# EAGLE design base-6u-db-opto-input (EAGLE 5.06)
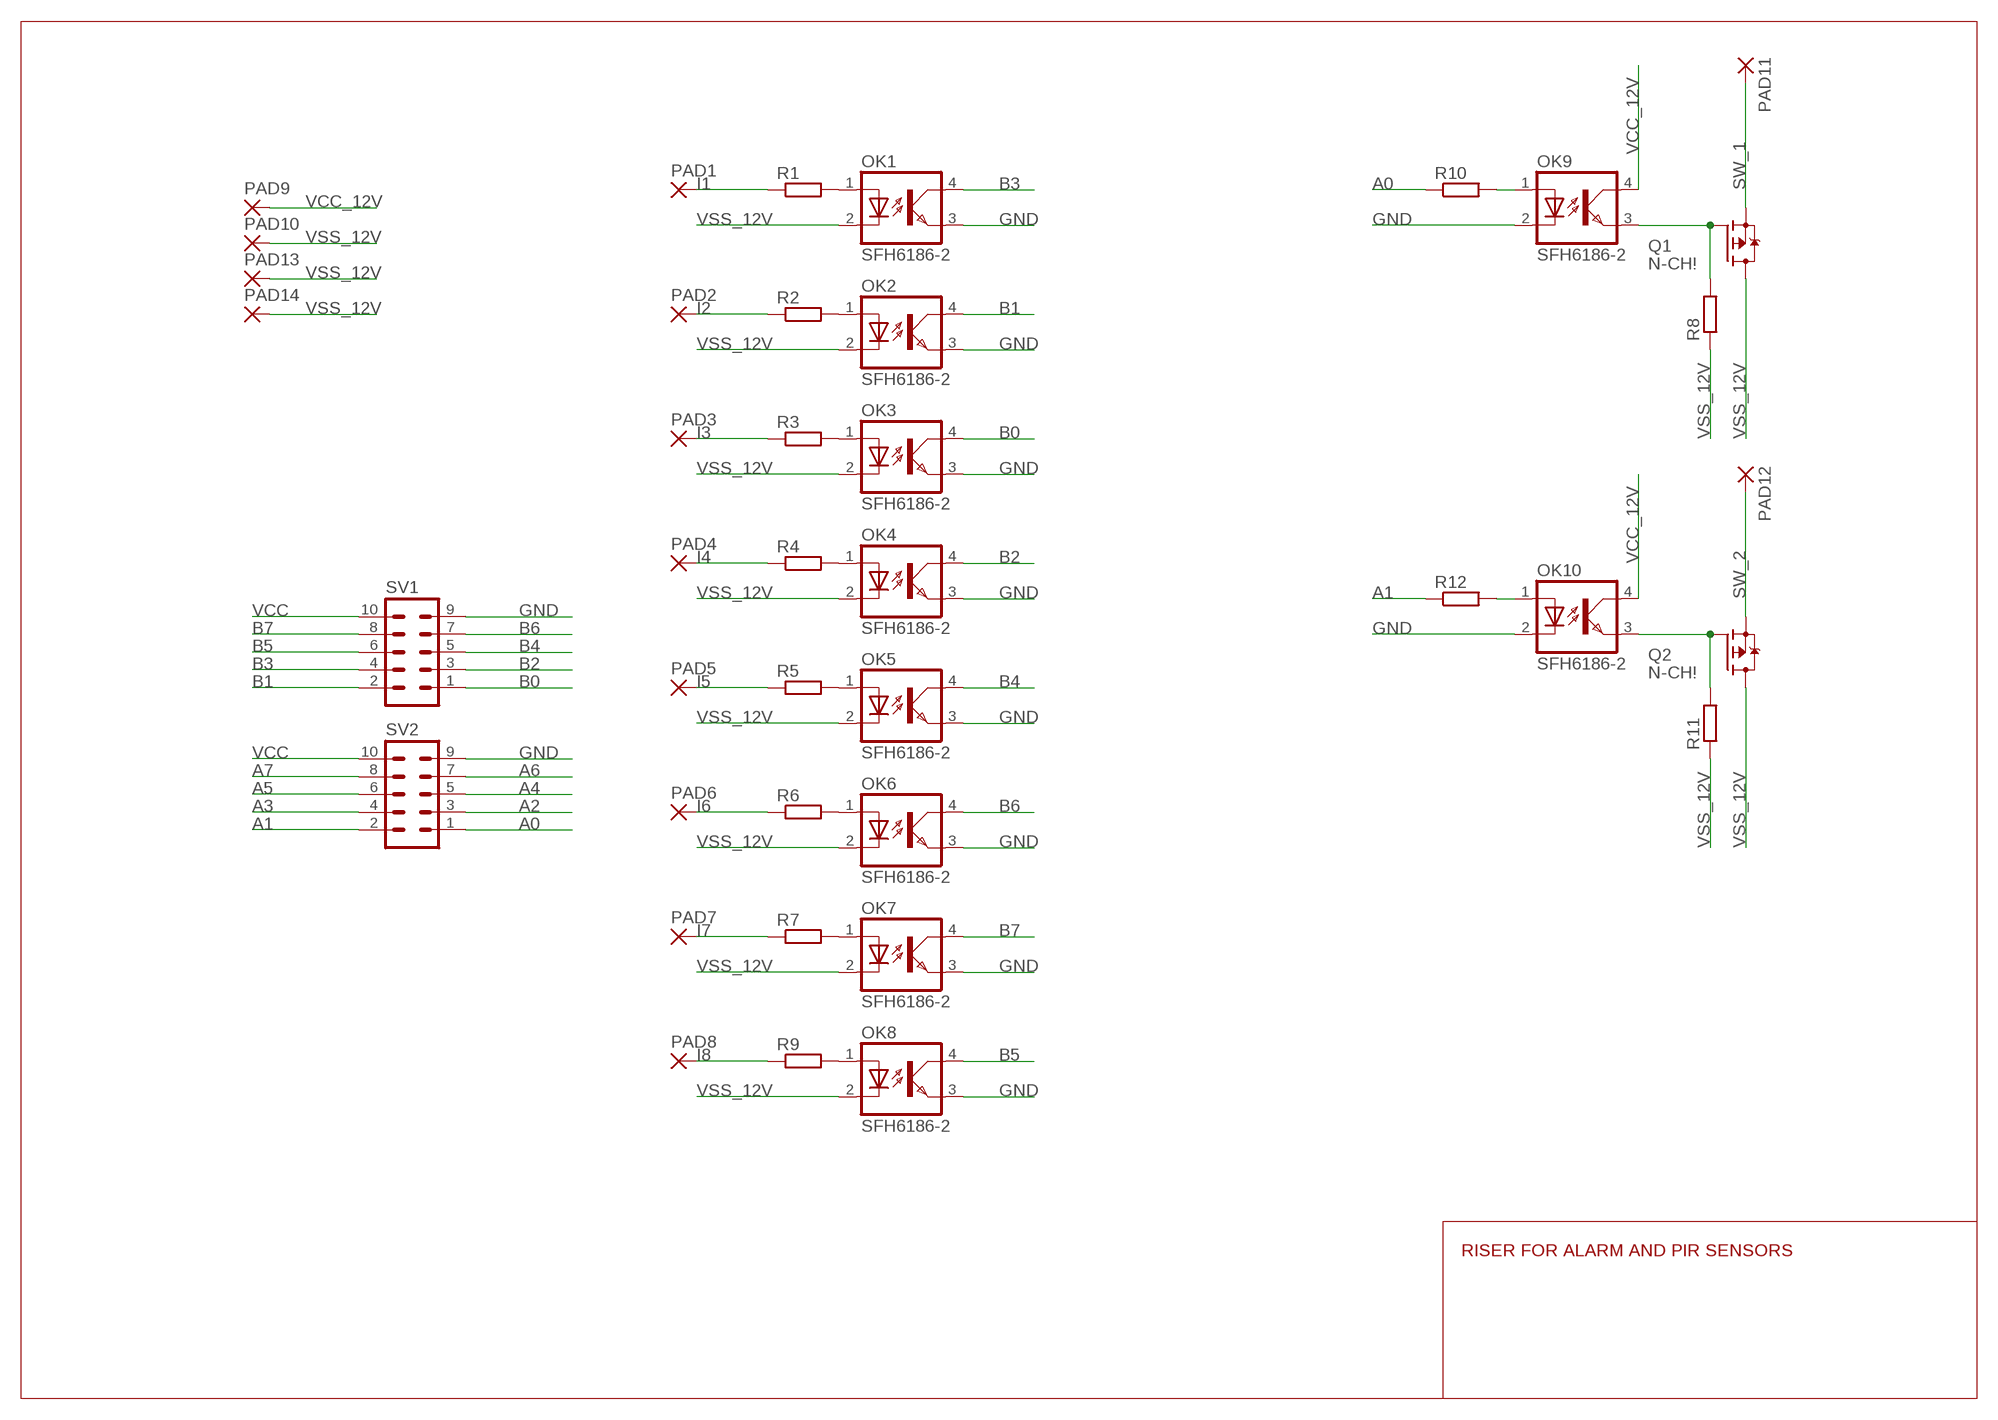
[diagram p0: schematic, sheet 1]

## Parts
OK1  SFH6186-2  [SMD4]
OK2  SFH6186-2  [SMD4]
OK3  SFH6186-2  [SMD4]
OK4  SFH6186-2  [SMD4]
OK5  SFH6186-2  [SMD4]
OK6  SFH6186-2  [SMD4]
OK7  SFH6186-2  [SMD4]
OK8  SFH6186-2  [SMD4]
OK9  SFH6186-2  [SMD4]
OK10  SFH6186-2  [SMD4]
PAD1  2,15/1,0  [2,15/1,0]
PAD2  2,15/1,0  [2,15/1,0]
PAD3  2,15/1,0  [2,15/1,0]
PAD4  2,15/1,0  [2,15/1,0]
PAD5  2,15/1,0  [2,15/1,0]
PAD6  2,15/1,0  [2,15/1,0]
PAD7  2,15/1,0  [2,15/1,0]
PAD8  2,15/1,0  [2,15/1,0]
PAD9  2,15/1,0  [2,15/1,0]
PAD10  2,15/1,0  [2,15/1,0]
PAD11  2,15/1,0  [2,15/1,0]
PAD12  2,15/1,0  [2,15/1,0]
PAD13  2,15/1,0  [2,15/1,0]
PAD14  2,15/1,0  [2,15/1,0]
Q1  N-CH!  FDD4141TO252  [TO252]
Q2  N-CH!  FDD4141TO252  [TO252]
R1  R-EU_R0805  [R0805]
R2  R-EU_R0805  [R0805]
R3  R-EU_R0805  [R0805]
R4  R-EU_R0805  [R0805]
R5  R-EU_R0805  [R0805]
R6  R-EU_R0805  [R0805]
R7  R-EU_R0805  [R0805]
R8  R-EU_R0805  [R0805]
R9  R-EU_R0805  [R0805]
R10  R-EU_R0805  [R0805]
R11  R-EU_R0805  [R0805]
R12  R-EU_R0805  [R0805]
SV1  MA05-2  [MA05-2]
SV2  MA05-2  [MA05-2]

## Nets
A0: R10.1 SV2.1
A1: R12.1 SV2.2
A2: SV2.3
A3: SV2.4
A4: SV2.5
A5: SV2.6
A6: SV2.7
A7: SV2.8
B0: OK3.4(COL) SV1.1
B1: OK2.4(COL) SV1.2
B2: OK4.4(COL) SV1.3
B3: OK1.4(COL) SV1.4
B4: OK5.4(COL) SV1.5
B5: OK8.4(COL) SV1.6
B6: OK6.4(COL) SV1.7
B7: OK7.4(COL) SV1.8
GND: OK1.3(EMIT) OK2.3(EMIT) OK3.3(EMIT) OK4.3(EMIT) OK5.3(EMIT) OK6.3(EMIT) OK7.3(EMIT) OK8.3(EMIT) OK9.2(C) OK10.2(C) SV1.9 SV2.9
I1: PAD1.1(P) R1.1
I2: PAD2.1(P) R2.1
I3: PAD3.1(P) R3.1
I4: PAD4.1(P) R4.1
I5: PAD5.1(P) R5.1
I6: PAD6.1(P) R6.1
I7: PAD7.1(P) R7.1
I8: PAD8.1(P) R9.1
N$1: OK9.3(EMIT) Q1.1(G) R8.2
N$2: OK1.1(A) R1.2
N$3: OK8.1(A) R9.2
N$4: OK2.1(A) R2.2
N$5: OK3.1(A) R3.2
N$6: OK4.1(A) R4.2
N$7: OK5.1(A) R5.2
N$8: OK6.1(A) R6.2
N$9: OK7.1(A) R7.2
N$10: OK9.1(A) R10.2
N$11: OK10.3(EMIT) Q2.1(G) R11.2
N$12: OK10.1(A) R12.2
SW_1: PAD11.1(P) Q1.3(S)
SW_2: PAD12.1(P) Q2.3(S)
VCC: SV1.10 SV2.10
VCC_12V: OK9.4(COL) OK10.4(COL) PAD9.1(P)
VSS_12V: OK1.2(C) OK2.2(C) OK3.2(C) OK4.2(C) OK5.2(C) OK6.2(C) OK7.2(C) OK8.2(C) PAD10.1(P) PAD13.1(P) PAD14.1(P) Q1.2(D) Q2.2(D) R8.1 R11.1

## Notes on the sheet
- RISER FOR ALARM AND PIR SENSORS

## Library data of the parts
OK1-OK10 = optocoupler:SFH618?*: Optocoupler, Phototransistor Output, Low Input Current Source: http://www.vishay.com/docs/83673/sfh618.pdf
PAD1-PAD14 = wirepad:2,15/1,0: THROUGH-HOLE PAD
Q1 Q2 = transistor-fet:FDD4141: P-Channel PowerTrench® MOSFET Source: FDD4141.pdf
R1-R12 = rcl:R-EU_: RESISTOR, European symbol
SV1 SV2 = con-lstb:MA05-2: PIN HEADER

## Net classes
1 thin: width 0.254 mm
2 z: width 0.127 mm

## Board
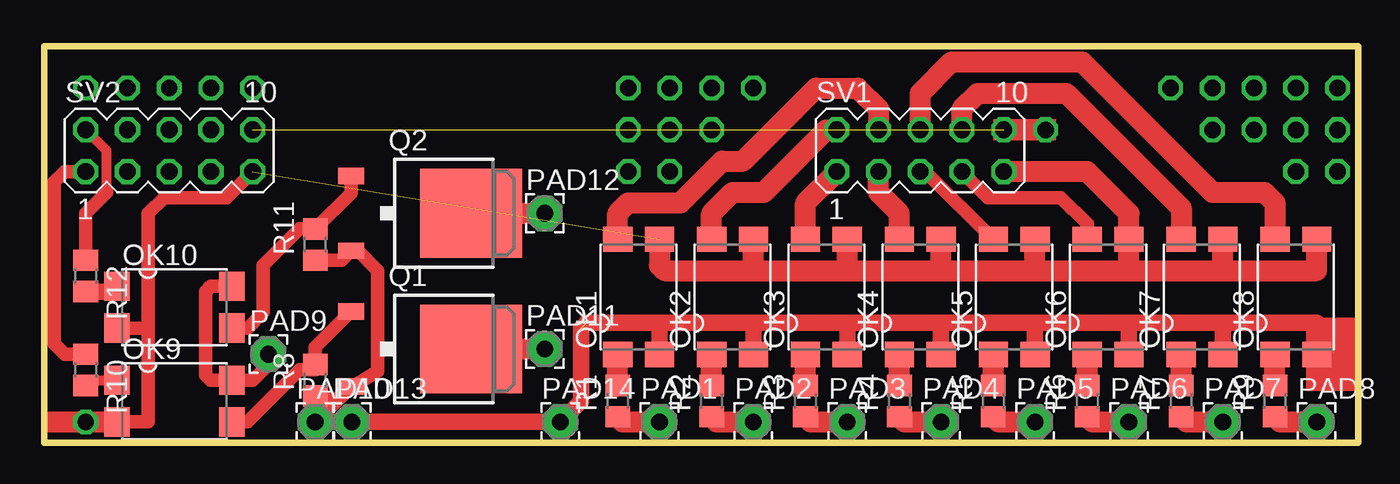
[diagram p1: board, top side]

Size 80.01 x 24.13 mm. Coordinates in mm from the lower left corner, seen from the top.
Outline: 0,24.13 0,0 80.01,0 80.01,24.13 0,24.13
Copper layers (1*16): Top 0.035mm / dielectric 1.5mm / Bottom 0.035mm
Design rules "default": minimum track width 10mil, minimum drill 24mil, track to track 8mil, track to pad 8mil, pad to pad 8mil, via to via 8mil, smd to smd 8mil, copper to edge 40mil, drill to drill 8mil, minimum pad ring 10mil, minimum via ring 8mil, stop-mask expansion 4mil, vias tented up to drill 0mil, thermal gap 10mil

### Footprints (pad centres in the part's own frame; a part is rotated, then mirrored left to right if it is on the bottom)
SMD4 = smd 1.78 x 1.55: 1 -1.27,-3.5; 2 1.27,-3.5; 3 1.27,3.5; 4 -1.27,3.5
2,15/1,0 = drill 1.016 pad 2.159 octagon: 1 0,0
TO252 = smd 1 x 1.6: 1 -2.28,-4.8; 2 2.28,-4.8 | smd 5.4 x 6.2: 3 0,2.5
R0805 = smd 1.3 x 1.5: 1 -0.95,0; 2 0.95,0
MA05-2 = drill 1.016 octagon: 1 -5.08,-1.27; 2 -5.08,1.27; 3 -2.54,-1.27; 4 -2.54,1.27; 5 0,-1.27; 6 0,1.27; 7 2.54,-1.27; 8 2.54,1.27; 9 5.08,-1.27; 10 5.08,1.27

### Placement (x,y rotation side)
OK1  36.2,8.89 0 top
OK2  41.91,8.89 0 top
OK3  47.62,8.89 0 top
OK4  53.34,8.89 0 top
OK5  59.06,8.89 0 top
OK6  64.77,8.89 0 top
OK7  70.48,8.89 0 top
OK8  76.2,8.89 0 top
OK9  7.94,2.54 270 top
OK10  7.94,8.26 270 top
PAD1  37.47,1.27 0 top
PAD2  43.18,1.27 0 top
PAD3  48.9,1.27 0 top
PAD4  54.61,1.27 0 top
PAD5  60.33,1.27 0 top
PAD6  66.04,1.27 0 top
PAD7  71.75,1.27 0 top
PAD8  77.47,1.27 0 top
PAD9  13.65,5.4 0 top
PAD10  16.51,1.27 0 top
PAD11  30.48,5.71 0 top
PAD12  30.48,13.97 0 top
PAD13  18.73,1.27 0 top
PAD14  31.43,1.27 0 top
Q1  23.49,5.71 270 top
Q2  23.49,13.97 270 top
R1  34.93,2.54 90 top
R2  40.64,2.54 90 top
R3  46.36,2.54 90 top
R4  52.07,2.54 90 top
R5  57.79,2.54 90 top
R6  63.5,2.54 90 top
R7  69.22,2.54 90 top
R8  16.51,3.81 90 top
R9  74.93,2.54 90 top
R10  2.54,4.45 270 top
R11  16.51,12.06 90 top
R12  2.54,10.16 270 top
SV1  53.34,17.78 0 top
SV2  7.62,17.78 0 top

### Tracks (layer width: path | path; a pad name or v marks a point on that pad's centre or on a via)
A0
  Top 0.813: R10.1 1.27,5.39 0.63,6.03 0.63,15.88 1.27,16.51 SV2.1
A1
  Top 0.61: 3.81,15.24 3.81,17.78 SV2.2
  Top 0.813: R12.1 2.54,12.06 2.54,13.97 3.81,15.24
B0
  Top 1.27: OK3.4 46.36,14.61 SV1.1
B1
  Top 1.27: OK2.4 40.64,13.97 41.91,15.24 43.82,15.24 47.62,19.05 SV1.2
B2
  Top 1.27: OK4.4 52.07,13.97 50.8,15.24 SV1.3
B3
  Top 1.27: OK1.4 34.93,13.97 35.56,14.61 38.73,14.61 41.27,17.14 42.55,17.14 46.99,21.59 49.53,21.59 50.8,20.32 SV1.4
B4
  Top 0.813: SV1.5 53.66,16.51 OK5.4
B5
  Top 1.27: OK8.4 74.93,14.61 74.3,15.24 71.12,15.24 63.18,23.18 55.25,23.18 53.34,21.27 SV1.6
B6
  Top 0.813: OK6.4 63.5,13.34 61.91,14.92 57.47,14.92 SV1.7
B7
  Top 1.27: OK7.4 69.22,14.29 62.23,21.27 56.83,21.27 55.88,20.32 SV1.8
GND  (1 unrouted)
  Top 0.813: SV2.9 11.11,14.92 7.3,14.92 6.35,13.97 6.35,11.75 6.35,6.99 | 6.35,6.99 6.35,1.27 OK9.2 | 6.35,6.99 OK10.2
  Top 1.27: SV1.9 63.5,16.51 66.04,13.97 OK6.3 66.04,10.48 | OK1.3 37.47,10.79 37.78,10.48 43.18,10.48 | 43.18,10.48 48.9,10.48 | 48.9,10.48 54.29,10.48 | 54.29,10.48 60.33,10.48 | 60.33,10.48 66.04,10.48 | 66.04,10.48 71.75,10.48 | 71.75,10.48 77.47,10.48 OK8.3 | 71.75,10.48 OK7.3 | 60.33,10.48 OK5.3 | OK4.3 54.61,10.79 54.29,10.48 | 48.9,10.48 OK3.3 | 43.18,10.48 OK2.3
I1
  Top 1.27: PAD1.1 35.25,1.27 R1.1
I2
  Top 1.27: PAD2.1 40.96,1.27 R2.1
I3
  Top 1.27: PAD3.1 46.68,1.27 R3.1
I4
  Top 1.27: PAD4.1 52.39,1.27 R4.1
I5
  Top 1.27: PAD5.1 58.11,1.27 R5.1
I6
  Top 1.27: PAD6.1 63.82,1.27 R6.1
I7
  Top 1.27: PAD7.1 69.53,1.27 R7.1
I8
  Top 1.27: PAD8.1 75.25,1.27 R9.1
N$1
  Top 0.813: Q1.1 16.51,5.81 R8.2 16.51,4.45 15.56,4.45 12.38,1.27 OK9.3
N$2
  Top 1.27: R1.2 OK1.1
N$3
  Top 1.27: R9.2 OK8.1
N$4
  Top 1.27: R2.2 OK2.1
N$5
  Top 1.27: R3.2 OK3.1
N$6
  Top 1.27: R4.2 OK4.1
N$7
  Top 1.27: R5.2 OK5.1
N$8
  Top 1.27: R6.2 OK6.1
N$9
  Top 1.27: R7.2 OK7.1
N$10
  Top 0.61: OK9.1 2.85,3.81 R10.2
N$11
  Top 0.813: OK10.3 12.38,6.99 13.33,7.94 13.33,10.79 15.56,13.02 R11.2 18.7,15.2 Q2.1
N$12
  Top 1.016: R12.2 4.44,9.21 OK10.1
N$13  (via drill 1)
  other vias: 10.16,21.59
N$14  (via drill 1)
  other vias: 7.62,21.59
N$15  (via drill 1)
  other vias: 5.08,21.59
N$16  (via drill 1)
  other vias: 2.54,21.59
N$17  (via drill 1)
  other vias: 12.7,21.59
N$18  (via drill 1)
  other vias: 2.54,1.27
N$19  (via drill 1)
  other vias: 71.12,19.05
N$20  (via drill 1)
  other vias: 71.12,21.59
N$21  (via drill 1)
  other vias: 68.58,21.59
N$22  (via drill 1)
  other vias: 73.66,21.59
N$23  (via drill 1)
  other vias: 73.66,19.05
N$24  (via drill 1)
  other vias: 76.2,19.05
N$25  (via drill 1)
  other vias: 76.2,21.59
N$26  (via drill 1)
  other vias: 78.74,21.59
N$27  (via drill 1)
  other vias: 78.74,19.05
N$28  (via drill 1)
  other vias: 78.74,16.51
N$29  (via drill 1)
  other vias: 76.2,16.51
N$30  (via drill 1)
  other vias: 40.64,19.05
N$31  (via drill 1)
  other vias: 40.64,21.59
N$32  (via drill 1)
  other vias: 43.18,21.59
N$33  (via drill 1)
  other vias: 38.1,21.59
N$34  (via drill 1)
  other vias: 38.1,19.05
N$35  (via drill 1)
  other vias: 38.1,16.51
N$36  (via drill 1)
  other vias: 35.56,16.51
N$37  (via drill 1)
  other vias: 35.56,19.05
N$38  (via drill 1)
  other vias: 35.56,21.59
N$39  (via drill 1)
  other vias: 60.96,19.05
SW_1
  Top 1.27: Q1.3 PAD11.1
SW_2
  Top 1.27: Q2.3 PAD12.1
VCC  (1 unrouted)
VCC_12V
  Top 0.813: OK10.4 10.16,9.53 9.84,9.21 9.84,4.13 10.16,3.81 OK9.4 12.7,3.81 13.65,4.76 PAD9.1
VSS_12V  (1 unrouted)
  Top 0.813: PAD10.1 18.73,3.4 | 18.73,3.4 Q1.2 17.68,2.54 R8.1 | 18.73,3.4 20.32,4.35 20.32,10.48 19.11,11.69 Q2.2 18.12,11.12 R11.1
  Top 1.016: 48.9,7.3 OK3.2 | 48.9,7.3 54.93,7.3 | 54.93,7.3 60.64,7.3 | 60.64,7.3 66.36,7.3 | 66.36,7.3 72.07,7.3 | 72.07,7.3 77.47,7.3 OK8.2 | OK7.2 71.75,6.99 72.07,7.3 | OK6.2 66.04,6.99 66.36,7.3 | OK5.2 60.33,6.99 60.64,7.3 | OK4.2 54.61,6.99 54.93,7.3 | 37.47,7.3 OK1.2 | 37.47,7.3 43.5,7.3 | 43.5,7.3 48.9,7.3 | OK2.2 43.18,6.99 43.5,7.3 | PAD10.1 PAD13.1 PAD14.1 32.7,2.54 32.7,6.99 | 33.02,7.3 37.47,7.3
(copper drawn outside any net)
  shapes: Top area x3